# EAGLE design PuzzleTemperatureHumidiy v1.0 (EAGLE 6.2)
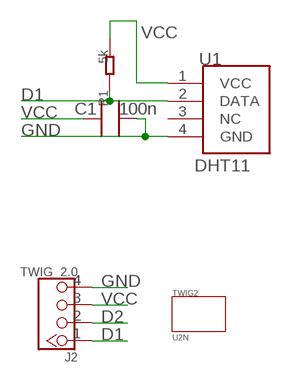
[diagram p0: schematic, sheet 1]

## Parts
C1  100n  C0603  [0603]
J2  TWIG_2.0  [2.0_1X4]
R1  5k  R0603  [0603]
TWIG2  U2N  [U2N]
U1  DHT11  [DHT11]

## Nets
D1: J2.1 R1.1 U1.2(DATA)
D2: J2.2
GND: C1.2 J2.4 U1.4(GND)
VCC: C1.1 J2.3 R1.2 U1.1(VCC)
Unconnected: U1.3(NC)

## Library data of the parts
C1 = CPT_SMD:C0603; C0603: 100N
J2 = CONNECTER:TWIG_2.0
R1 = CPT_SMD:R0603
TWIG2 = twig_template1:U2N
U1 = Sensors:DHT11

## Board
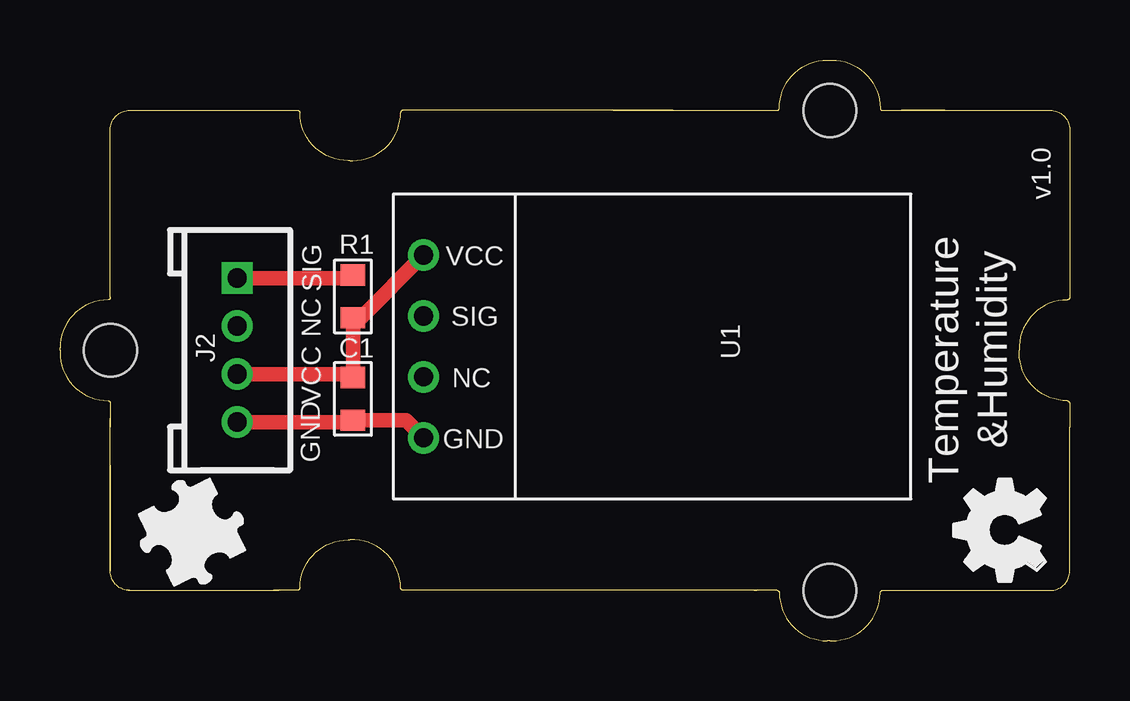
[diagram p1: board, top side]
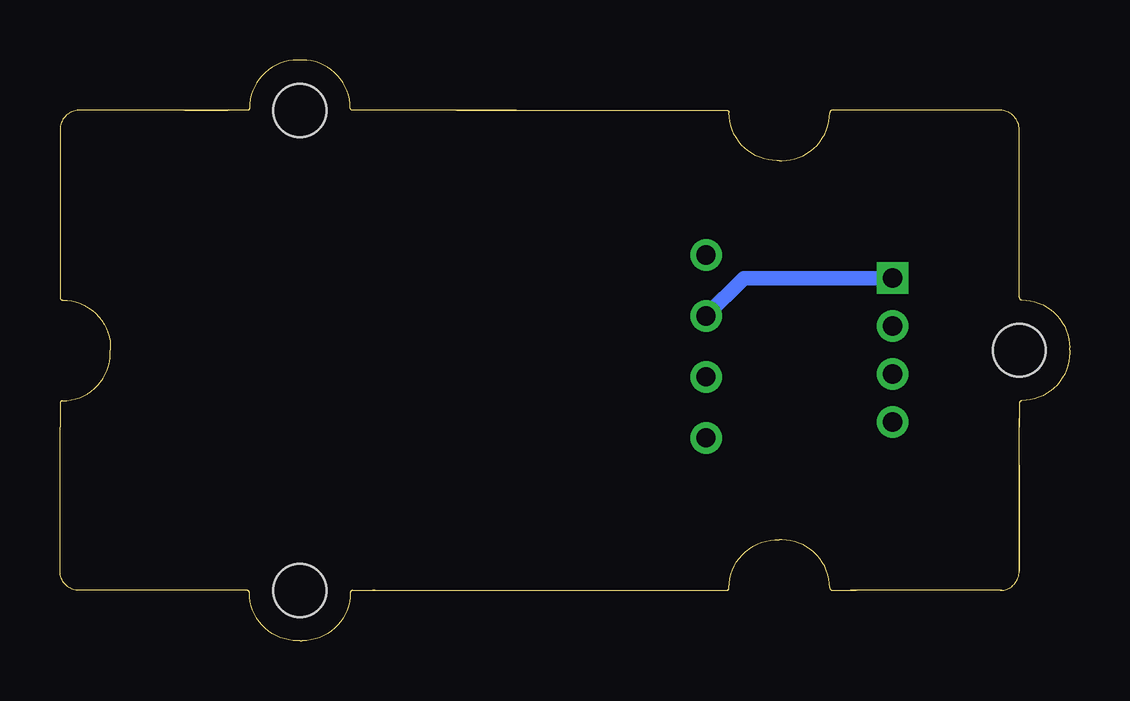
[diagram p2: board, bottom side, seen from below]

Size 42.09 x 24.2 mm. Coordinates in mm from the lower left corner, seen from the top.
Copper layers (1*16): Top 0.035mm / dielectric 1.5mm / Bottom 0.035mm
Design rules: minimum track width 6mil, minimum drill 12mil, track to track 6mil, track to pad 6mil, pad to pad 6mil, via to via 6mil, smd to smd 0mil, copper to edge 10mil, drill to drill 10mil, minimum pad ring 10mil, minimum via ring 6mil, stop-mask expansion 2mil, vias tented up to drill 100mil, thermal gap 10mil

### Footprints (pad centres in the part's own frame; a part is rotated, then mirrored left to right if it is on the bottom)
0603 = smd 0.889 x 1.016: 1 -0.889,0; 2 0.889,0
2.0_1X4 = drill 0.8 pad 1.27 square: 1 -3,0 | drill 0.8 pad 1.27: 2 -1,0; 3 1,0; 4 3,0
U2N = hole 2.2: 10.453,-10.42; 10.453,9.58; -19.535,-0.415
DHT11 = drill 0.8: 1 -3.81,-3.81; 2 -1.27,-3.81; 3 1.27,-3.81; 4 3.81,-3.81

### Placement (x,y rotation side)
C1  12.21,10.08 270 top
J2  7.39,12.11 270 top
R1  12.21,14.35 270 top
TWIG2  21.64,12.52 0 top
U1  18.97,12.27 270 top
U$1  [OPHW-LOGO-FILL-150]  41.07,2.49 90 top
U$2  [BRICK-LOGO-MIL-0.5]  2.97,1.98 0 top

### Tracks (layer width: path | path; a pad name or v marks a point on that pad's centre or on a via)
D1
  Top 0.61: R1.1 12.21,15.14 12.19,15.11 J2.1
  Bottom 0.61: U1.2 13.58,15.11 J2.1
GND
  Top 0.61: J2.4 12.13,9.11 C1.2 14.42,9.19 U1.4
VCC
  Top 0.61: J2.3 12.07,11.11 C1.1 R1.2 12.54,13.46 U1.1

### Text on the board
tPlace: v1.0 | SIG | VCC | SIG | VCC | NC | NC | GND | &Humidity | GND | Temperature